# EAGLE design bmscable (EAGLE 4.13)
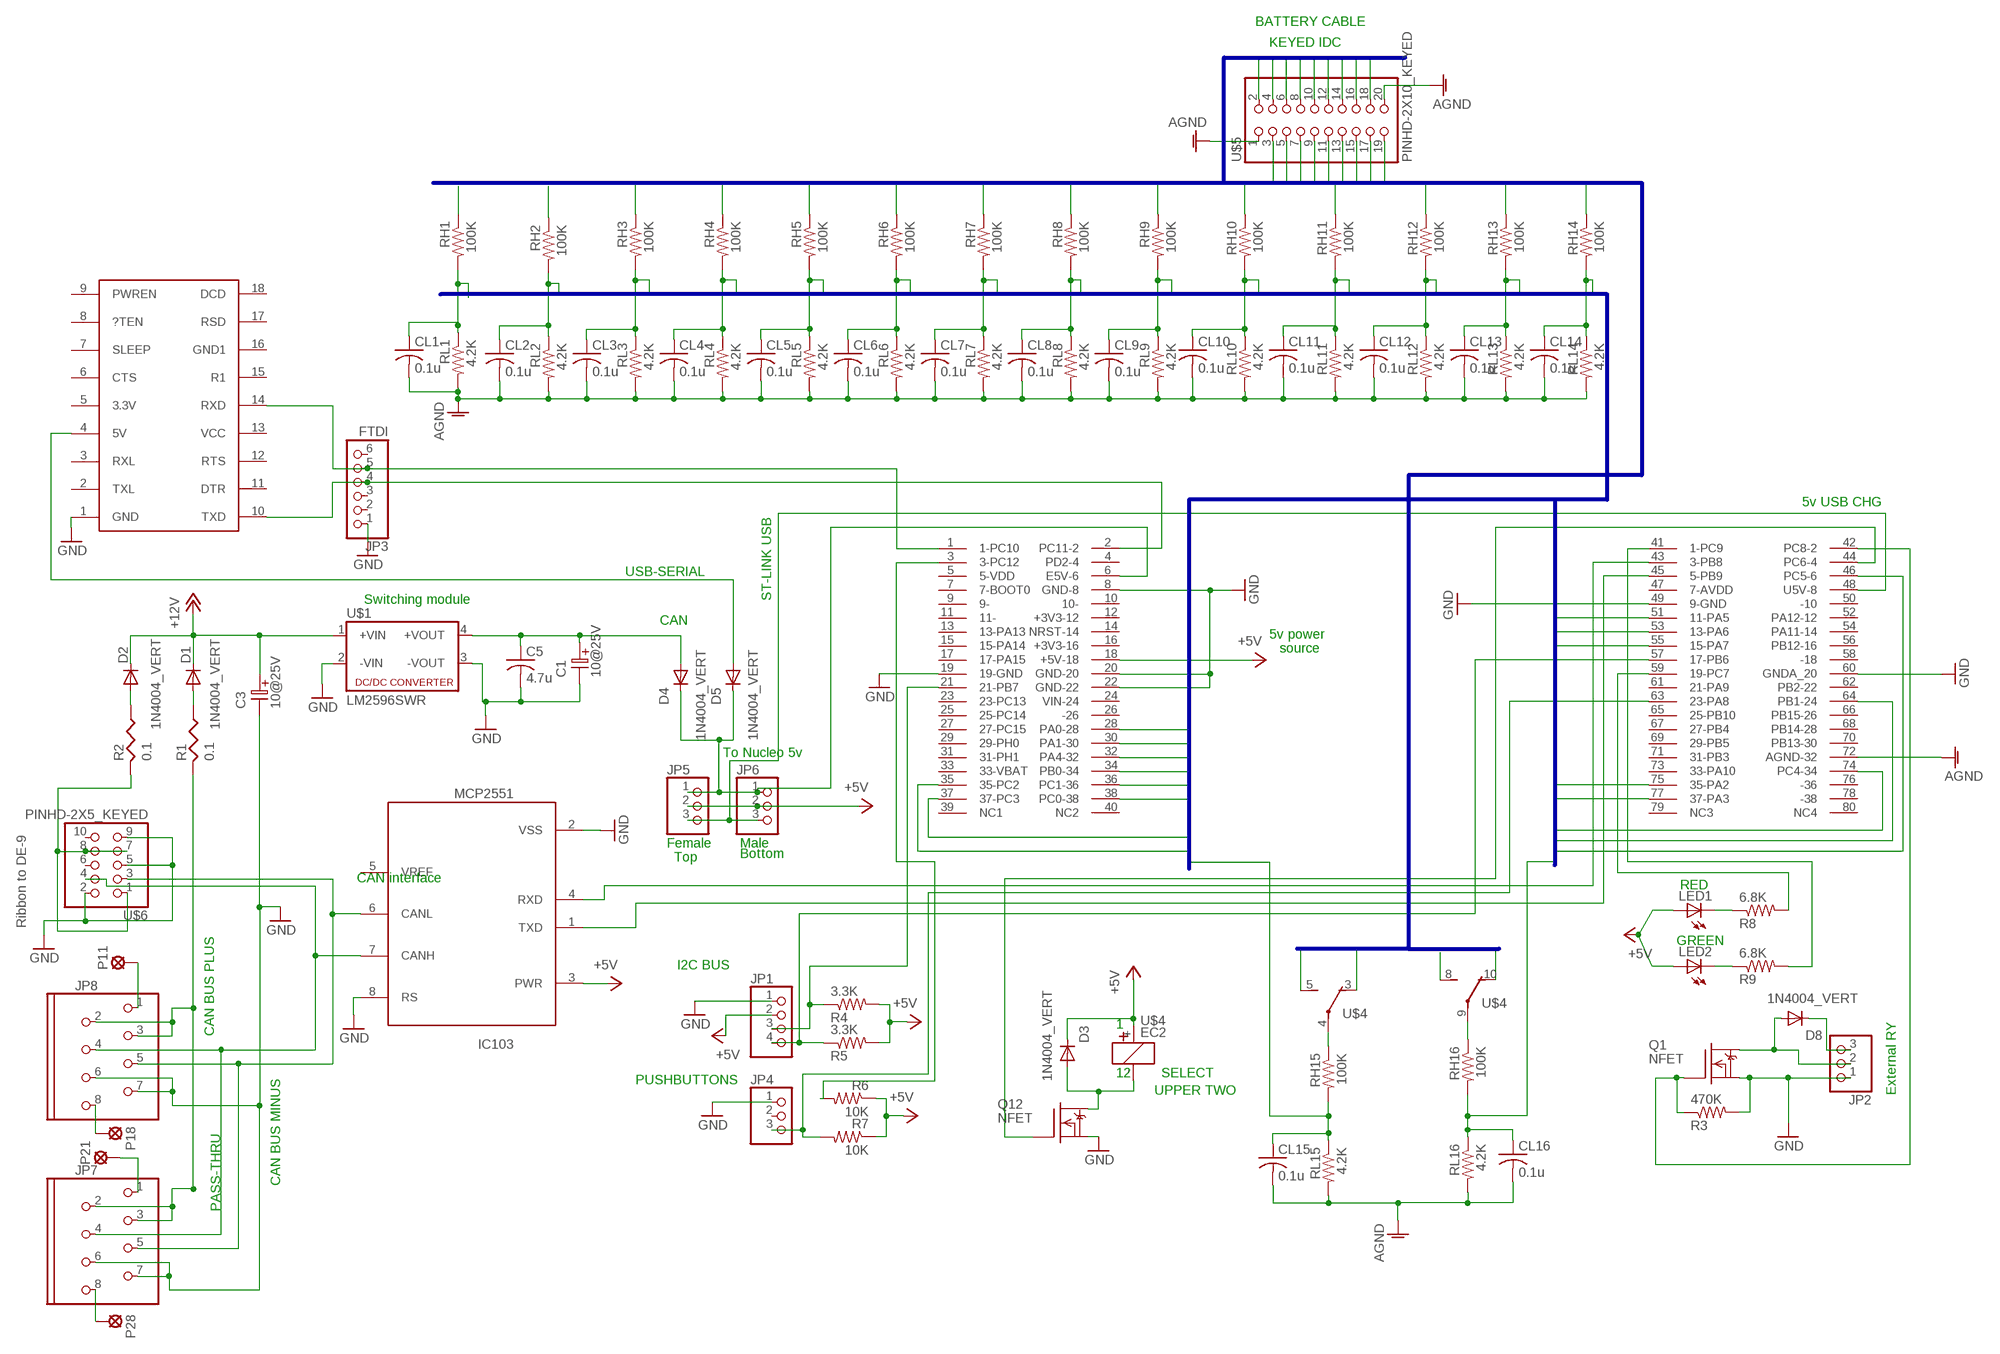
[diagram p0: schematic, sheet 1]

## Parts
C1  10@25V  ELC-2,5L  [ES-2,5L]
C3  10@25V  ELC-2,5L  [ES-2,5L]
C5  4.7u  C-USC0603  [C0603]
CL1  0.1u  C-USC0603  [C0603]
CL2  0.1u  C-USC0603  [C0603]
CL3  0.1u  C-USC0603  [C0603]
CL4  0.1u  C-USC0603  [C0603]
CL5  0.1u  C-USC0603  [C0603]
CL6  0.1u  C-USC0603  [C0603]
CL7  0.1u  C-USC0603  [C0603]
CL8  0.1u  C-USC0603  [C0603]
CL9  0.1u  C-USC0603  [C0603]
CL10  0.1u  C-USC0603  [C0603]
CL11  0.1u  C-USC0603  [C0603]
CL12  0.1u  C-USC0603  [C0603]
CL13  0.1u  C-USC0603  [C0603]
CL14  0.1u  C-USC0603  [C0603]
CL15  0.1u  C-USC0603  [C0603]
CL16  0.1u  C-USC0603  [C0603]
D1  1N4004_VERT  [DO41-10_VERT]
D2  1N4004_VERT  [DO41-10_VERT]
D3  1N4004_VERT  [DO41-10_VERT]
D4  1N4004_VERT  [DO41-10_VERT]
D5  1N4004_VERT  [DO41-10_VERT]
D8  1N4004_VERT  [DO41-10_VERT]
IC103  MCP2551  [SO-08]
JP1  PINHD-1X4  [1X04]
JP2  PINHD-1X3  [1X03]
JP3  FTDI  PINHD-1X6  [1X06]
JP4  PINHD-1X3  [1X03]
JP5  PINHD-1X3  [1X03]
JP6  PINHD-1X3  [1X03]
JP7  MOD8P8C  [MOD8P8C]
JP8  MOD8P8C  [MOD8P8C]
LED1  LEDCHIP-LED0603  [CHIP-LED0603]
LED2  LEDCHIP-LED0603  [CHIP-LED0603]
P11  SOLPAD035  [SOLDPAD035]
P18  SOLPAD035  [SOLDPAD035]
P21  SOLPAD035  [SOLDPAD035]
P28  SOLPAD035  [SOLDPAD035]
Q1  NFET  DMN3404L  [SOT-23]
Q12  NFET  DMN3404L  [SOT-23]
R1  0.1  RESUS-S2,5  [RS-2,5]
R2  0.1  RESUS-S2,5  [RS-2,5]
R3  470K  R-US_R0603  [R0603]
R4  3.3K  R-US_R0603  [R0603]
R5  3.3K  R-US_R0603  [R0603]
R6  10K  R-US_R0603  [R0603]
R7  10K  R-US_R0603  [R0603]
R8  6.8K  R-US_R0603  [R0603]
R9  6.8K  R-US_R0603  [R0603]
RH1  100K  R-US_R0603  [R0603]
RH2  100K  R-US_R0603  [R0603]
RH3  100K  R-US_R0603  [R0603]
RH4  100K  R-US_R0603  [R0603]
RH5  100K  R-US_R0603  [R0603]
RH6  100K  R-US_R0603  [R0603]
RH7  100K  R-US_R0603  [R0603]
RH8  100K  R-US_R0603  [R0603]
RH9  100K  R-US_R0603  [R0603]
RH10  100K  R-US_R0603  [R0603]
RH11  100K  R-US_R0603  [R0603]
RH12  100K  R-US_R0603  [R0603]
RH13  100K  R-US_R0603  [R0603]
RH14  100K  R-US_R0603  [R0603]
RH15  100K  R-US_R0603  [R0603]
RH16  100K  R-US_R0603  [R0603]
RL1  4.2K  R-US_R0603  [R0603]
RL2  4.2K  R-US_R0603  [R0603]
RL3  4.2K  R-US_R0603  [R0603]
RL4  4.2K  R-US_R0603  [R0603]
RL5  4.2K  R-US_R0603  [R0603]
RL6  4.2K  R-US_R0603  [R0603]
RL7  4.2K  R-US_R0603  [R0603]
RL8  4.2K  R-US_R0603  [R0603]
RL9  4.2K  R-US_R0603  [R0603]
RL10  4.2K  R-US_R0603  [R0603]
RL11  4.2K  R-US_R0603  [R0603]
RL12  4.2K  R-US_R0603  [R0603]
RL13  4.2K  R-US_R0603  [R0603]
RL14  4.2K  R-US_R0603  [R0603]
RL15  4.2K  R-US_R0603  [R0603]
RL16  4.2K  R-US_R0603  [R0603]
U$1  LM2596SWR  [LM2596SW]
U$2  NUCLEO446R-20  [NUCLEO-64-20]
U$3  USB-UART  [USB-UART]
U$4  EC2  [EC2]
U$5  PINHD-2X10_KEYED  [2X10_KEYED]
U$6  PINHD-2X5_KEYED  [2X05_KEYED]

## Nets
+5V: D3.C IC103.3(PWR) JP1.2 JP5.2 JP6.2 LED1.A LED2.A R4.2 R5.2 R6.1 R7.1 U$2.18(+5V-18) U$4.+
+12V: C3.1 D1.C D2.C U$1.1(+VIN)
ADC0: CL1.1 RH1.2 RL1.1 U$2.28(PA0-28)
ADC1: CL2.1 RH2.2 RL2.1 U$2.30(PA1-30)
ADC2: CL3.1 RH3.2 RL3.1 U$2.75(35-PA2)
ADC3: CL4.1 RH4.2 RL4.1 U$2.77(37-PA3)
ADC4: CL5.1 RH5.2 RL5.1 U$2.32(PA4-32)
ADC5: CL6.1 RH6.2 RL6.1 U$2.51(11-PA5)
ADC6: CL7.1 RH7.2 RL7.1 U$2.53(13-PA6)
ADC7: CL8.1 RH8.2 RL8.1 U$2.55(15-PA7)
ADC8: CL9.1 RH9.2 RL9.1 U$2.34(PB0-34)
ADC9: CL10.1 RH10.2 RL10.1 U$2.64(PB1-24)
ADC10: CL11.1 RH11.2 RL11.1 U$2.38(PC0-38)
ADC11: CL12.1 RH12.2 RL12.1 U$2.36(PC1-36)
ADC12: CL13.1 RH13.2 RL13.1 U$2.35(35-PC2)
ADC13: CL14.1 RH14.2 RL14.1 U$2.37(37-PC3)
ADC14: CL15.1 RH15.2 RL15.1 U$2.74(PC4-34)
ADC15: CL16.1 RH16.2 RL16.1 U$2.46(PC5-6)
AGND: CL1.2 CL2.2 CL3.2 CL4.2 CL5.2 CL6.2 CL7.2 CL8.2 CL9.2 CL10.2 CL11.2 CL12.2 CL13.2 CL14.2 CL15.2 CL16.2 RL1.2 RL2.2 RL3.2 RL4.2 RL5.2 RL6.2 RL7.2 RL8.2 RL9.2 RL10.2 RL11.2 RL12.2 RL13.2 RL14.2 RL15.2 RL16.2 U$2.72(AGND-32) U$5.1 U$5.20
C1: RH1.1 U$5.11
C2: RH2.1 U$5.2
C3: RH3.1 U$5.12
C4: RH4.1 U$5.3
C5: RH5.1 U$5.13
C6: RH6.1 U$5.4
C7: RH7.1 U$5.14
C8: RH8.1 U$5.5
C9: RH9.1 U$5.15
C10: RH10.1 U$5.6
C11: RH11.1 U$5.16
C12: RH12.1 U$5.7
C13: RH13.1 U$5.17
C14: RH14.1 U$5.8
C15: U$4.5(S) U$5.18
C16: U$4.8(S) U$5.9
C17: U$4.3(O) U$5.19
C18: U$4.10(O) U$5.10
CAN_RAW_PLUS: JP7.2 JP7.3 JP8.2 JP8.3 R1.2
CANCABLE_1_1: JP8.1 P11.MP
CANCABLE_1_8: JP8.8 P18.MP
CANCABLE_2_1: JP7.1 P21.MP
CANCABLE_2_8: JP7.8 P28.MP
D1-RESISTOR: D1.A R1.1
D2-RESISTOR: D2.A R2.1
E5V->NUCLEO: D4.C D5.C JP5.1 JP6.1 U$2.6(E5V-6)
FROM-DC-DC=CAN: C1.1 C5.1 D4.A U$1.4(+VOUT)
FROM-U5V: JP5.3 JP6.3 U$2.48(U5V-8)
FROM-USB-UART: D5.A U$3.4(5V)
GND: C1.2 C3.2 C5.2 IC103.2(VSS) IC103.8(RS) JP1.1 JP2.1 JP3.1 JP4.1 JP7.6 JP7.7 JP8.6 JP8.7 Q1.2(S) Q12.2(S) R3.2 U$1.2(-VIN) U$1.3(-VOUT) U$2.8(GND-8) U$2.19(19-GND) U$2.20(GND-20) U$2.22(GND-22) U$2.49(9-GND) U$2.60(GNDA_20) U$3.1(GND) U$6.2 U$6.5 U$6.9
MCP2551_CANH: IC103.7(CANH) JP7.4 JP8.4 U$6.4
MCP2551_CANL: IC103.6(CANL) JP7.5 JP8.5 U$6.3
N$3: R2.2 U$6.1 U$6.7 U$6.8
N$4: D8.A JP2.2 Q1.3(D)
N$5: D8.C JP2.3
N$6: JP4.3 R7.2 U$2.63(23-PA8)
N$7: LED2.C R9.1
N$8: RH16.1 U$4.9(P)
N$9: RH15.1 U$4.4(P)
N$10: LED1.C R8.1
PB6-I2C1-SCL: JP1.4 R5.1 U$2.57(17-PB6)
PB7-I2C1-SCL: JP1.3 R4.1 U$2.21(21-PB7)
PB8-CAN-RX: IC103.4(RXD) U$2.43(3-PB8)
PB9-CAN-TX: IC103.1(TXD) U$2.45(5-PB9)
PC6-Q12-GATE: Q12.1(G) U$2.44(PC6-4)
PC7-LED-GREEN: R8.2 U$2.59(19-PC7)
PC8-FETGATE-CHGR-RELAY: Q1.1(G) R3.1 U$2.42(PC8-2)
PC9-LED-RED: R9.2 U$2.41(1-PC9)
PC12-SWITCH: R6.2 U$2.3(3-PC12)
Q12-DRAIN-RELAY: D3.A Q12.3(D) U$4.-
USART3-RX: JP3.4 U$2.2(PC11-2) U$3.10(TXD)
USART3-TX: JP3.5 U$2.1(1-PC10) U$3.14(RXD)
Unconnected: IC103.5(VREF) JP3.2 JP3.3 JP3.6 JP4.2 U$2.4(PD2-4) U$2.5(5-VDD) U$2.7(7-BOOT0) U$2.9(9-) U$2.10(10-) U$2.11(11-) U$2.12(+3V3-12) U$2.13(13-PA13) U$2.14(NRST-14) U$2.15(15-PA14) U$2.16(+3V3-16) U$2.17(17-PA15) U$2.23(23-PC13) U$2.24(VIN-24) U$2.25(25-PC14) U$2.26(-26) U$2.27(27-PC15) U$2.29(29-PH0) U$2.31(31-PH1) U$2.33(33-VBAT) U$2.39(NC1) U$2.40(NC2) U$2.47(7-AVDD) U$2.50(-10) U$2.52(PA12-12) U$2.54(PA11-14) U$2.56(PB12-16) U$2.58(-18) U$2.61(21-PA9) U$2.62(PB2-22) U$2.65(25-PB10) U$2.66(PB15-26) U$2.67(27-PB4) U$2.68(PB14-28) U$2.69(29-PB5) U$2.70(PB13-30) U$2.71(31-PB3) U$2.73(33-PA10) U$2.76(-36) U$2.78(-38) U$2.79(NC3) U$2.80(NC4) U$3.2(TXL) U$3.3(RXL) U$3.5(3.3V) U$3.6(CTS) U$3.7(SLEEP) U$3.8(?TEN) U$3.9(PWREN) U$3.11(DTR) U$3.12(RTS) U$3.13(VCC) U$3.15(R1) U$3.16(GND1) U$3.17(RSD) U$3.18(DCD) U$6.6 U$6.10

## Buses
C$1:C[0..18]
ADC$:ADC[0..15]

## Notes on the sheet
- BATTERY CABLE
- KEYED IDC
- 5v USB CHG
- USB-SERIAL
- Switching module | ST-LINK USB
- CAN
- 5v power
- source
- To Nucleo 5v
- Female | Male
- Top | Bottom
- CAN interface
- RED
- Ribbon to DE-9
- GREEN
- I2C BUS
- 1
- CAN BUS PLUS
- 12 | SELECT
- PUSHBUTTONS
- UPPER TWO | External RY
- PASS-THRU
- CAN BUS MINUS

## Library data of the parts
C1 C3 = DEH:ELC-2,5L
C5 CL1-CL16 = rcl:C-US: CAPACITOR, American symbol
D1-D5 D8 = diode:1N4004_VERT
IC103 = texas:MCP2551
JP1 = pinhead:PINHD-1X4: PIN HEADER
JP2 JP4-JP6 = pinhead:PINHD-1X3: PIN HEADER
JP3 = pinhead:PINHD-1X6: PIN HEADER
JP7 JP8 = DEH:MOD8P8C
LED1 LED2 = led:LED: LED OSRAM: - CHIPLED LG R971, LG N971, LY N971, LG Q971, LY Q971, LO R971, LY R971 LH N974, LH R974 LS Q976, LO Q976, LY Q976 LO Q996 - Hyper CHIPLED LW Q18S LB Q993, LB Q99A, LB R99A - SideLED LS A670, LO A670, LY A670, LG A670, LP A670 LB A673, LV A673, LT A673, LW A673 LH A674 LY A675 LS A676, LA A676, LO A676, LY A676, LW A676 LS A679, LY A679, LG A679 - Hyper Micro SIDELED® LS Y876, LA Y876, LO Y876, LY Y876 LT Y87S - SmartLED LW L88C, LW L88S LB L89C, LB L89S, LG L890 LS L89K, LO L89K, LY L89K LS L896, LA L896, LO L896, LY L896 - TOPLED LS T670, LO T670, LY T670, LG T670, LP T670 LSG T670, LSP T670, LSY T670, LOP T670, LYG T670 LG T671, LOG T671, LSG T671 LB T673, LV T673, LT T673, LW T673 LH T674 LS T676, LA T676, LO T676, LY T676, LB T676, LH T676, LSB T676, LW T676 LB T67C, LV T67C, LT T67C, LS T67K, LO T67K, LY T67K, LW E67C LS E67B, LA E67B, LO E67B, LY E67B, LB E67C, LV E67C, LT E67C LW T67C LS T679, LY T679, LG T679 LS T770, LO T770, LY T770, LG T770, LP T770 LB T773, LV T773, LT T773, LW T773 LH T774 LS E675, LA E675, LY E675, LS T675 LS T776, LA T776, LO T776, LY T776, LB T776 LHGB T686 LT T68C, LB T68C - Hyper Mini TOPLED® LB M676 - Mini TOPLED Santana® LG M470 LS M47K, LO M47K, LY M47K Source: http://www.osram.convergy.de/
P11 P18 P21 P28 = solpad:SOLPAD035
Q1 Q12 = transistor-fet:DMN3404L
R1 R2 = DEH:RESUS-S2,5
R3-R9 RH1-RH16 RL1-RL16 = rcl:R-US_: RESISTOR, American symbol
U$1 = dc-dc-converter:LM2596SWR
U$2 = pinhead:NUCLEO446R-20
U$3 = pinhead:USB-UART
U$4 = relay:EC2
U$5 = pinhead:PINHD-2X10_KEYED
U$6 = pinhead:PINHD-2X5_KEYED

## Board
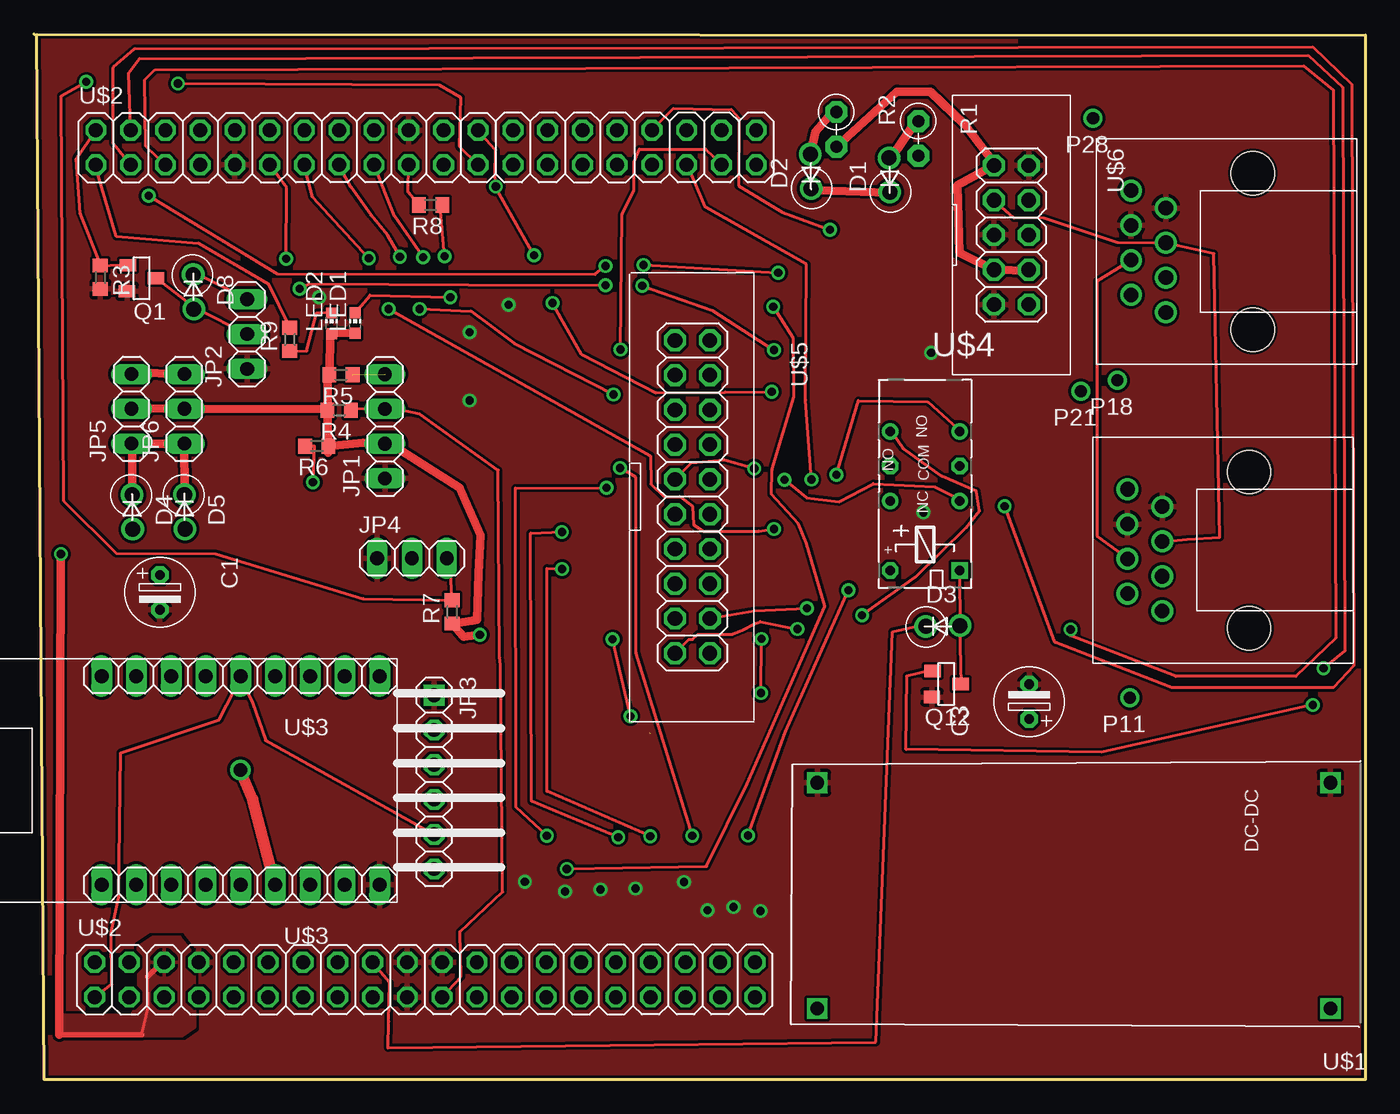
[diagram p1: board, top side]
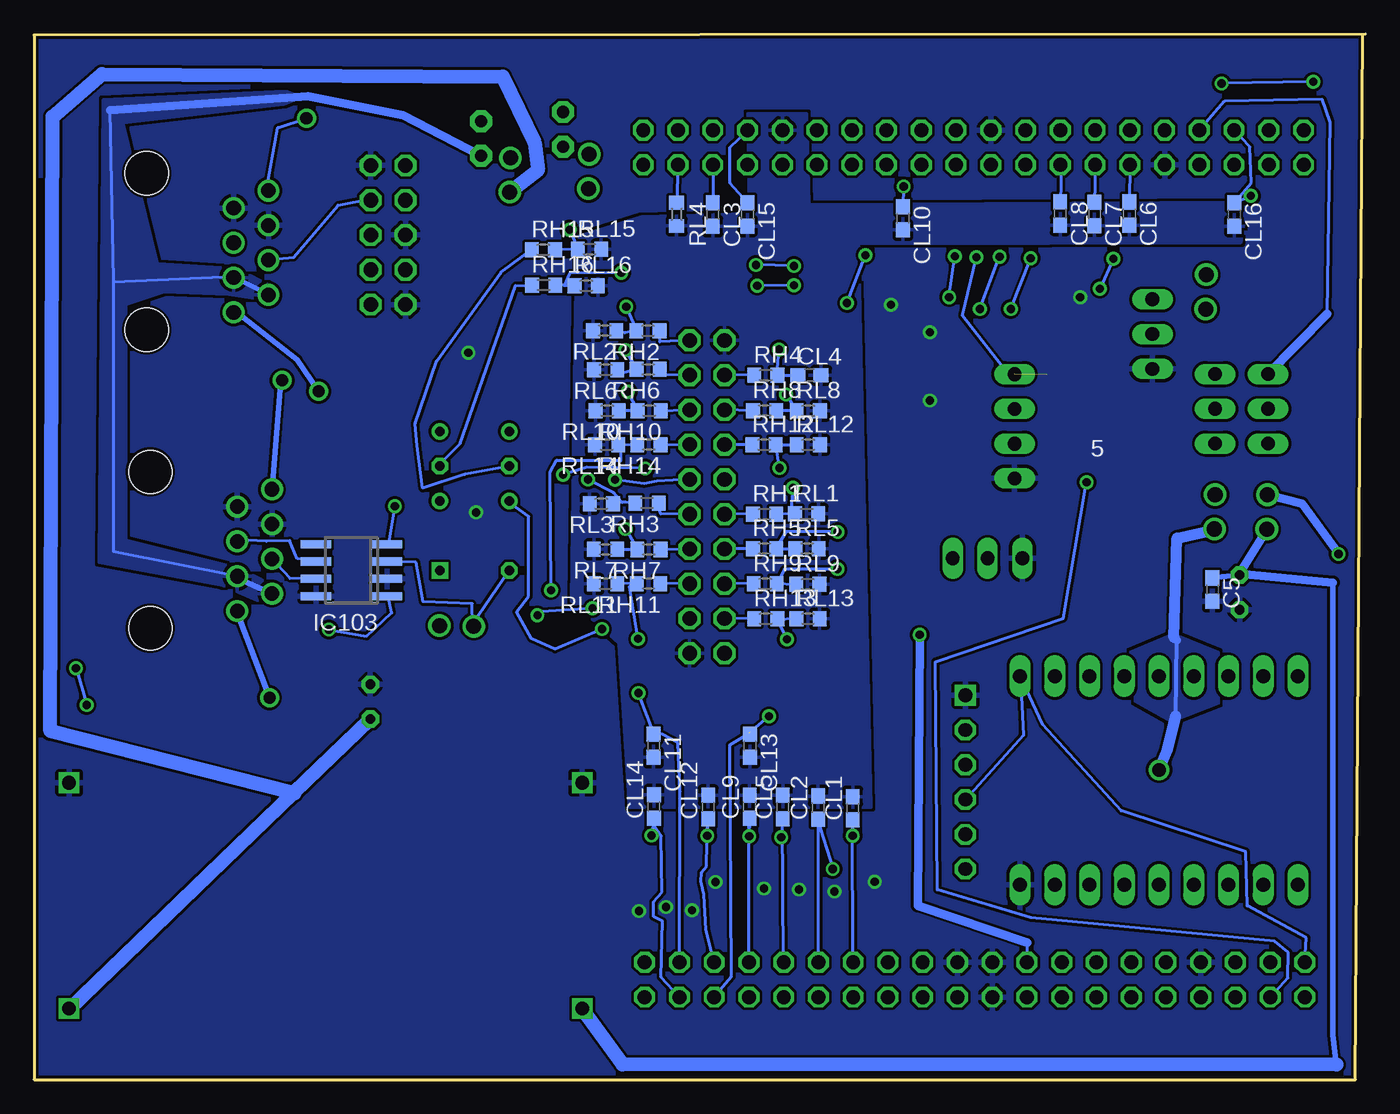
[diagram p2: board, bottom side, seen from below]

Size 97.29 x 76.38 mm. Coordinates in mm from the lower left corner, seen from the top.
Outline: 0.19,76.35 0.72,0 97.29,0 97.29,76.31 0,76.38
Copper layers (1*16): Top 0.035mm / dielectric 1.5mm / Bottom 0.035mm
Design rules "default": minimum track width 8mil, minimum drill 0.6mm, track to track 8mil, track to pad 8mil, pad to pad 8mil, via to via 8mil, smd to smd 0mil, copper to edge 8mil, drill to drill 8mil, minimum pad ring 10mil, minimum via ring 8mil, stop-mask expansion 4mil, vias tented up to drill 0mil, thermal gap 10mil

### Footprints (pad centres in the part's own frame; a part is rotated, then mirrored left to right if it is on the bottom)
ES-2,5L = drill 0.711 pad 1.27 octagon: 1 0,0; 2 2.54,0
C0603 = smd 1.1 x 1: 1 -0.85,0; 2 0.85,0
DO41-10_VERT = drill 1.1 round: A 2.58,0.05; C 0.07,0
SO-08 = smd 0.6 x 2.2: 1 -1.905,-2.6; 2 -0.635,-2.6; 3 0.635,-2.6; 4 1.905,-2.6; 5 1.905,2.6; 6 0.635,2.6; 7 -0.635,2.6; 8 -1.905,2.6
1X04 = drill 1 long: 1 -3.81,0; 2 -1.27,0; 3 1.27,0; 4 3.81,0
1X03 = drill 1 long: 1 -2.54,0; 2 0,0; 3 2.54,0
1X06 = drill 1 square: 1 -6.35,0 | drill 1 octagon: 2 -3.81,0; 3 -1.27,0; 4 1.27,0; 5 3.81,0; 6 6.35,0
MOD8P8C = drill 1.067 pad 1.397 round: 1 -3.81,-2.54; 2 -2.54,0; 3 -1.27,-2.54; 4 0,0; 5 1.27,-2.54; 6 2.54,0; 7 3.81,-2.54; 8 5.08,0 | hole 3.175: -5.08,-8.89; 6.35,-8.89
CHIP-LED0603 = smd 0.8 x 0.8: A 0,-0.75; C 0,0.75
SOLDPAD035 = drill 0.889 pad 1.27 round: MP 0,0
SOT-23 = smd 0.9 x 1.2: 1 -1,-1.006; 2 0.9,-1.056; 3 -0.05,1.056
RS-2,5 = drill 0.889 pad 1.6 octagon: 1 0,0; 2 2.54,0
R0603 = smd 1 x 1.1: 1 -0.85,0; 2 0.85,0
LM2596SW = drill 1 square: 1 0,16.5; 2 0,0; 3 37.5,0; 4 37.5,16.5
NUCLEO-64-20 = drill 1.016 octagon: 1 -31.68,24.23; 2 -29.14,24.23; 3 -31.68,21.69; 4 -29.14,21.69; 5 -31.68,19.15; 6 -29.14,19.15; 7 -31.68,16.61; 8 -29.14,16.61; 9 -31.68,14.07; 10 -29.14,14.07; 11 -31.68,11.53; 12 -29.14,11.53; 13 -31.68,8.99; 14 -29.14,8.99; 15 -31.68,6.45; 16 -29.14,6.45; 17 -31.68,3.91; 18 -29.14,3.91; 19 -31.68,1.37; 20 -29.14,1.37; 21 -31.68,-1.17; 22 -29.14,-1.17; 23 -31.68,-3.71; 24 -29.14,-3.71; 25 -31.68,-6.25; 26 -29.14,-6.25; 27 -31.68,-8.79; 28 -29.14,-8.79; 29 -31.68,-11.33; 30 -29.14,-11.33; 31 -31.68,-13.87; 32 -29.14,-13.87; 33 -31.68,-16.41; 34 -29.14,-16.41; 35 -31.68,-18.95; 36 -29.14,-18.95; 37 -31.68,-21.49; 38 -29.14,-21.49; 39 -31.68,-24.03; 40 -29.14,-24.03; 41 29.12,24.13; 42 31.66,24.13; 43 29.12,21.59; 44 31.66,21.59; 45 29.12,19.05; 46 31.66,19.05; 47 29.12,16.51; 48 31.66,16.51; 49 29.12,13.97; 50 31.66,13.97; 51 29.12,11.43; 52 31.66,11.43; 53 29.12,8.89; 54 31.66,8.89; 55 29.12,6.35; 56 31.66,6.35; 57 29.12,3.81; 58 31.66,3.81; 59 29.12,1.27; 60 31.66,1.27; 61 29.12,-1.27; 62 31.66,-1.27; 63 29.12,-3.81; 64 31.66,-3.81; 65 29.12,-6.35; 66 31.66,-6.35; 67 29.12,-8.89; 68 31.66,-8.89; 69 29.12,-11.43; 70 31.66,-11.43; 71 29.12,-13.97; 72 31.66,-13.97; 73 29.12,-16.51; 74 31.66,-16.51; 75 29.12,-19.05; 76 31.66,-19.05; 77 29.12,-21.59; 78 31.66,-21.59; 79 29.12,-24.13; 80 31.66,-24.13
USB-UART = drill 1.016 long: 1 -7.62,-8.89; 2 -7.62,-6.35; 3 -7.62,-3.81; 4 -7.62,-1.27; 5 -7.62,1.27; 6 -7.62,3.81; 7 -7.62,6.35; 8 -7.62,8.89; 9 -7.62,11.43; 10 7.62,-8.89; 11 7.62,-6.35; 12 7.62,-3.81; 13 7.62,-1.27; 14 7.62,1.27; 15 7.62,3.81; 16 7.62,6.35; 17 7.62,8.89; 18 7.62,11.43
EC2 = drill 0.7 round: 3 -1.27,2.54; 5 3.81,2.54; 8 3.81,-2.54; 10 -1.27,-2.54 | drill 0.7 octagon: 4 1.27,2.54; 9 1.27,-2.54; + -6.35,2.54 | drill 0.7 square: - -6.35,-2.54
2X10_KEYED = drill 1.067 octagon: 1 -11.46,-1.27; 2 -11.46,1.27; 3 -8.92,-1.27; 4 -8.92,1.27; 5 -6.38,-1.27; 6 -6.38,1.27; 7 -3.84,-1.27; 8 -3.84,1.27; 9 -1.3,-1.27; 10 -1.3,1.27; 11 1.24,-1.27; 12 1.24,1.27; 13 3.78,-1.27; 14 3.78,1.27; 15 6.32,-1.27; 16 6.32,1.27; 17 8.86,-1.27; 18 8.86,1.27; 19 11.4,-1.27; 20 11.4,1.27
2X05_KEYED = drill 1.067 octagon: 1 -5.08,-1.27; 2 -5.08,1.27; 3 -2.54,-1.27; 4 -2.54,1.27; 5 0,-1.27; 6 0,1.27; 7 2.54,-1.27; 8 2.54,1.27; 9 5.08,-1.27; 10 5.08,1.27

### Placement (x,y rotation side)
C1  9.19,36.87 270 top
C3  72.72,26.34 90 top
C5  11.18,35.8 270 bottom
CL1  37.46,19.83 90 bottom
CL2  39.99,19.87 90 bottom
CL3  47.69,63.2 270 bottom
CL4  40.63,51.46 0 bottom
CL5  42.57,19.91 90 bottom
CL6  17.25,63.27 270 bottom
CL7  19.8,63.24 270 bottom
CL8  22.3,63.28 270 bottom
CL9  45,19.93 90 bottom
CL10  33.8,62.93 270 bottom
CL11  52.02,24.39 270 bottom
CL12  48.03,19.91 90 bottom
CL13  44.98,24.39 270 bottom
CL14  51.99,19.95 90 bottom
CL15  45.16,63.21 270 bottom
CL16  9.58,63.21 270 bottom
D1  62.53,64.77 90 top
D2  56.78,65.03 90 top
D3  65.09,33.12 0 top
D4  7.15,42.8 270 top
D5  10.98,42.81 270 top
D8  11.62,58.88 270 top
IC103  74.1,37.22 90 bottom
JP1  25.64,47.73 90 top
JP2  15.56,54.47 90 top
JP3  29.23,21.73 270 top
JP4  27.61,38.09 0 top
JP5  7.11,49.01 90 top
JP6  10.97,49.01 90 top
JP7  80.17,59.87 90 top
JP8  79.91,38.05 90 top
LED1  23.46,55.27 0 top
LED2  21.73,55.26 0 top
P11  80.09,27.9 180 top
P18  79.17,51.09 180 top
P21  76.5,50.3 180 top
P28  77.39,70.24 180 top
Q1  7.85,58.5 270 top
Q12  66.67,28.85 270 top
R1  64.62,70.03 270 top
R2  58.63,70.7 270 top
R3  4.84,58.62 270 top
R4  22.29,48.9 180 top
R5  22.42,51.49 180 top
R6  20.65,46.29 180 top
R7  30.54,34.17 90 top
R8  28.97,63.9 180 top
R9  18.68,54.08 90 top
RH1  43.91,41.31 0 bottom
RH2  52.43,54.71 180 bottom
RH3  52.5,42.12 180 bottom
RH4  43.82,51.46 0 bottom
RH5  43.91,38.8 0 bottom
RH6  52.41,51.89 180 bottom
RH7  52.36,38.73 180 bottom
RH8  43.9,48.88 0 bottom
RH9  43.86,36.22 0 bottom
RH10  52.34,48.87 180 bottom
RH11  52.39,36.24 180 bottom
RH12  43.94,46.39 0 bottom
RH13  43.82,33.67 0 bottom
RH14  52.36,46.4 180 bottom
RH15  60.07,60.63 0 bottom
RH16  60.05,58.05 0 bottom
RL1  40.83,41.33 0 bottom
RL2  55.59,54.73 180 bottom
RL3  55.84,42.08 180 bottom
RL4  50.33,63.22 270 bottom
RL5  40.8,38.8 0 bottom
RL6  55.52,51.87 180 bottom
RL7  55.53,38.74 180 bottom
RL8  40.71,48.86 0 bottom
RL9  40.75,36.19 0 bottom
RL10  55.41,48.87 180 bottom
RL11  55.53,36.22 180 bottom
RL12  40.71,46.38 0 bottom
RL13  40.73,33.67 0 bottom
RL14  55.45,46.38 180 bottom
RL15  56.7,60.66 0 bottom
RL16  56.94,58.01 0 bottom
U$1  94.74,21.69 180 top
U$2  28.64,37.71 90 top
U$3  16.35,21.86 90 top
U$4  65.11,43.55 90 top
U$5  48.11,42.55 270 top
U$6  71.42,61.71 270 top

### Tracks (layer width: path | path; a pad name or v marks a point on that pad's centre or on a via)
+5V  (via drill 0.6)
  Top 0.203: U$2.18 24.67,8.62 25.97,7.07 25.91,4.23 25.85,2.31 61.51,2.74 62.74,32.71 65,33.22 D3.C
  Top 0.61: JP5.2 7.04,49.05 JP6.2 21.5,48.99 R4.2 | LED1.A 21.86,54.56 LED2.A 21.68,54.61 R5.2 21.43,51.53 R4.2 | R4.2 21.49,45.8 R6.1 24.05,46.53 26.08,46.41 | 26.08,46.41 JP1.2 | 26.08,46.41 31.1,43.25 32.61,39.77 32.47,37 32.38,33.61 32.02,33.53 R7.1 31.39,32.35 v32.57,32.5
  Bottom 0.203: IC103.3 69.38,37.79 68.88,34.93 65.28,34.77 65.24,33.23 D3.C 65.28,33.27 U$4.+ | U$2.18 24.68,10
  Bottom 0.61: 24.68,10 32.7,12.71 v32.57,32.5
+12V
  Top 0.203: 57.22,64.97 D2.C | D1.C 62.51,64.78
  Top 0.61: 62.51,64.78 57.22,64.97
  Bottom 0.406: 94.76,5.09 U$1.1 94.71,5.09
  Bottom 1.016: 94.76,5.09 78.31,20.95 | 78.31,20.95 C3.1 | D1.C 60.48,66.45 60.72,68.46 63.05,73.29 92.34,73.47 95.94,70.36 96.11,25.46 78.28,20.92 78.31,20.95
ADC0  (via drill 0.6)
  Top 0.203: v37.47,17.82 35.21,19.9 35.18,43.21 v41.84,43.25
  Bottom 0.203: 37.5,19.05 CL1.1 | U$2.28 37.5,19.05 | RH1.2 42.98,41.3 RL1.1 42.01,41.35 v41.84,43.25 | 37.5,19.05 v37.47,17.82
ADC1  (via drill 0.6)
  Top 0.203: v54.02,56.46 55.49,54.16 55.52,49.9 53.94,44.55 53.87,42.78 55.85,40.62 56.44,39.17 57.78,34.59 52.1,21.59 49.14,15.57 v38.92,15.39
  Bottom 0.203: RL2.1 54.13,54.55 RH2.2 v54.02,56.46 | U$2.30 39.96,19.08 CL2.1 40.04,19 v38.92,15.39
ADC2  (via drill 0.6)
  Top 0.203: v56.81,43.84 56.38,49.64 56.44,59.56 49.05,63.74 47.75,66.84 U$2.75
  Bottom 0.203: U$2.75 47.66,66.74 CL3.1 | RL3.1 54.32,42.17 RH3.2 54.39,42.23 54.95,42.86 v56.81,43.84
ADC3  (via drill 0.6)
  Top 0.203: U$2.77 50.22,66.88 49.08,67.99 44.24,67.99 43.84,67.02 43.84,64.97 42.98,63.19 v42.85,53.35
  Bottom 0.203: RH4.2 43.01,51.47 | 43.01,51.47 CL4.1 | U$2.77 50.22,66.8 RL4.1 | 43.01,51.47 v42.85,53.35
ADC4  (via drill 0.6)
  Top 0.203: v38.57,40.01 36.28,39.92 36.37,20.32 v42.69,17.71
  Bottom 0.203: U$2.32 42.6,19.13 CL5.1 42.59,19.06 v42.69,17.71 | RL5.1 43.11,38.79 RH5.2 42.35,40.02 v38.57,40.01
ADC5  (via drill 0.6)
  Top 0.203: v54.07,53.3 49.55,56.2 v44.44,58.01 | v41.76,58.04 31.74,58.06 20.09,58.15 v19.4,57.79 | v18.42,59.97 18.45,65.15 17.22,66.86 U$2.51
  Bottom 0.203: RL6.1 54.68,51.5 RH6.2 v54.07,53.3 | U$2.51 17.21,66.86 CL6.1 | v41.76,58.04 v44.44,58.01 | v18.42,59.97 v19.4,57.79
ADC6  (via drill 0.6)
  Top 0.203: v54.07,40.23 52.96,40.07 48.93,40.06 48.19,40.53 48.13,41.89 47.2,42.6 46.02,42.59 45.07,43.51 45.03,45.58 v25.91,56.31 | v24.46,60.01 20.36,64.48 19.72,66.8 U$2.53
  Bottom 0.203: U$2.53 19.73,66.79 CL7.1 | RL7.1 54.8,38.73 RH7.2 v54.07,40.23 | v25.91,56.31 v24.46,60.01
ADC7  (via drill 0.6)
  Top 0.203: v42.34,50.06 35.09,53.81 31.92,56.14 v28.16,56.31 | v26.73,60.13 25.84,61.69 24.61,63.15 23.15,65.21 22.25,66.83 U$2.55
  Bottom 0.203: RH8.2 43.03,48.86 RL8.1 v42.34,50.06 | U$2.55 22.22,66.86 CL8.1 | v28.16,56.31 v26.73,60.13
ADC8  (via drill 0.6)
  Top 0.203: v38.58,37.3 37.47,37.35 37.47,21.05 v45.03,17.79
  Bottom 0.203: U$2.34 45.03,19.2 CL9.1 45.01,18.95 v45.03,17.79 | RL9.1 41.68,36.18 43.05,36.25 RH9.2 42.46,37.3 v38.58,37.3
ADC9  (via drill 0.6)
  Top 0.203: v33.74,65.26 33.68,66.05 33.73,67.92 32.36,69.39 U$2.64 | v53.91,50.26 50.5,50.23 45.46,50.19 40,53 v37.88,56.74 | v33.74,65.26 33.72,65.24 | v33.74,65.26 33.69,65.27 v36.53,60.24
  Bottom 0.203: RL10.1 54.62,48.86 RH10.2 v53.91,50.26 | v33.74,65.26 CL10.1 | v37.88,56.74 v36.53,60.24
ADC10  (via drill 0.6)
  Top 0.203: v53.12,28.24 v53.16,32.2
  Bottom 0.203: U$2.38 50.08,21.05 50.24,24.61 51.41,25.25 52,25.28 | 52,25.28 CL11.1 | RL11.1 54.64,36.26 RH11.2 53.76,36.05 v53.16,32.2 | 52,25.28 v53.12,28.24
ADC11  (via drill 0.6)
  Top 0.203: v42.82,44.69 43.97,44 44,31.2 v48.1,17.81
  Bottom 0.203: RL12.1 43.05,46.37 RH12.2 v42.82,44.69 | U$2.36 48.19,10.94 48.34,13.52 48.56,14.46 48.53,15.14 48.16,15.6 48.08,19 CL12.1 48.04,18.94 v48.1,17.81
ADC12  (via drill 0.6)  (1 unrouted)
  Top 0.203: v43.58,26.55 v42.28,32.17
  Bottom 0.203: U$2.35 46.34,7.52 46.42,24.48 44.96,25.35 | RL13.1 41.6,33.69 43.04,33.65 RH13.2 v42.28,32.17 | CL13.1 45.03,25.3 v43.58,26.55
ADC13  (via drill 0.6)
  Top 0.203: v52.17,17.84 54.92,25.43 v59.52,35.76
  Bottom 0.203: RH14.2 54.63,46.42 RL14.1 54.4,46.43 54.4,45.2 54.52,45.24 59.1,45.26 59.6,44.38 v59.52,35.76 | U$2.37 51.47,7.49 51.38,11.58 52.01,11.91 52.02,12.99 51.42,13.7 51.47,17.79 51.96,18.49 51.95,19.05 CL14.1 v52.17,17.84
ADC14  (via drill 0.6)
  Top 0.203: v58.17,62.1 54.69,63.39 51.49,65.32 51.52,70.24 50.95,70.87 46.72,70.96 45.13,69.35 U$2.74
  Bottom 0.203: CL15.1 46.43,65.5 46.43,68.11 45.12,69.37 U$2.74 | RH15.2 RL15.1 v58.17,62.1
ADC15  (via drill 0.6)
  Top 0.203: v8.36,64.57 17.74,58.88 41,58.83 v41.76,59.45 | v44.53,59.52 v54.38,58.95
  Bottom 0.203: U$2.46 9.57,69.37 8.44,68.15 8.35,65.54 CL16.1 v8.36,64.57 | RH16.2 58.97,58.07 58.57,58.02 | RL16.1 57.91,57.95 58.57,58.02 | v41.76,59.45 v44.53,59.52 | v54.38,58.95 58.15,58.91 58.57,58.02
AGND
  pour Bottom (rank 2): 53.78,19.88 54.55,31.85 58.03,34.95 57.72,56.2 57.58,61.63 52.86,63.09 45,63.3 45.11,70.63 40.86,70.62 40.65,63.97 8.64,64.13 9.1,61.11 37.03,61.02 36.13,19.88
C1
  Bottom 0.203: U$5.11 46.91,41.33 RH1.1
C2
  Bottom 0.203: RH2.1 51.56,53.91 U$5.2
C3
  Bottom 0.203: RH3.1 51.5,41.33 U$5.12
C4
  Bottom 0.203: U$5.3 46.89,51.49 RH4.1
C5
  Bottom 0.203: RH5.1 44.73,38.8 U$5.13
C6
  Bottom 0.203: RH6.1 51.92,51.5 U$5.4
C7
  Bottom 0.203: RH7.1 51.7,38.74 U$5.14
C8
  Bottom 0.203: U$5.5 46.88,48.94 RH8.1
C9
  Bottom 0.203: RH9.1 44.71,36.26 U$5.15
C10
  Bottom 0.203: RH10.1 51.76,48.88 U$5.6
C11
  Bottom 0.203: RH11.1 51.7,36.28 U$5.16
C12
  Bottom 0.203: U$5.7 RH12.1
C13
  Bottom 0.203: RH13.1 44.4,33.68 U$5.17
C14
  Bottom 0.203: RH14.1 51.76,46.43 U$5.8
C15  (via drill 0.6)
  Top 0.203: U$5.18 52.64,34.27 v56.48,34.44 | v60.51,33.93 64.43,36.73 68.09,40.31 69.09,41.56 68.86,42.99 66.35,44.08 63.51,46.14 62.6,47.43 U$4.5
  Bottom 0.203: v56.48,34.44 60.74,34.16 v60.51,33.93
C16  (via drill 0.6)
  Top 0.203: U$5.9 48.05,45.08 50.45,45.29 v52.63,44.65 | v58.64,44.2 60.23,49.6 65.32,49.51 67.81,47.28 U$4.8
  Bottom 0.203: v52.63,44.65 56.89,44.75 v58.64,44.2
C17  (via drill 0.6)
  Top 0.203: U$5.19 47.85,32.16 48.13,32.16 48.5,32.53 50.99,32.53 51.82,32.86 52.65,33.32 53.08,33.47 v55.79,32.92
  Bottom 0.203: v55.79,32.92 59.22,31.45 60.94,32.22 62.02,34.18 61.17,35.33 61.14,41.15 62.71,42.31 U$4.3
C18  (via drill 0.6)
  Top 0.203: v54.84,43.83 56.44,42.52 58.82,42.21 61.33,43.54 65.84,43.3 67.8,42.32 U$4.10
  Bottom 0.203: U$5.10 51.79,43.73 52.71,43.54 v54.84,43.83
CAN_RAW_PLUS
  Bottom 0.203: JP8.3 91.49,38.57 91.49,58.3 | JP7.3 82.69,58.7 91.49,58.3 | 91.49,58.3 91.49,58.39 91.75,70.83
  Bottom 0.406: JP7.3 82.65,58.61 JP7.2 | JP8.3 82.69,36.75 JP8.2
  Bottom 0.61: R1.2 70.32,70.45 77.26,71.86 91.75,70.83
  pour Bottom (rank 2): 80.68,34.89 79.64,35.53 79.85,36.1 82.19,37.34 90.57,39.42 90.56,56.64 87.83,57.55 83.06,57.37 79.99,56.89 79.78,57.85 82.47,59.25 88.25,59.62 90.8,69.92 79.06,71.28 77.77,71.78 78.93,72.22 92.28,71.59 92.58,37.81 83.5,36.13
CANCABLE_1_1
  Bottom 0.406: JP8.1 82.51,34.21 P11.MP
CANCABLE_1_8
  Bottom 0.406: P18.MP 79.25,51.36 JP8.8
CANCABLE_2_1
  Bottom 0.406: P21.MP 78.07,52.58 82.69,56.21 JP7.1
CANCABLE_2_8
  Bottom 0.203: P28.MP 79.48,69.55 80.34,64.87 JP7.8
D1-RESISTOR
  Top 0.203: D1.A 62.77,67.53 | 64.56,70.18 R1.1
  Top 0.61: 62.77,67.53 64.56,70.18
D2-RESISTOR
  Top 0.203: 58.28,70.6 R2.1
  Top 0.61: D2.A 57.1,69.27 58.28,70.6
E5V->NUCLEO  (via drill 0.6)
  Top 0.203: 7.86,3.26 8.34,5.29 8.28,7.5
  Top 0.406: 1.83,3.26 7.86,3.26 | U$2.6 9.59,8.75 8.28,7.5
  Top 0.61: JP5.1 7,46.47 | JP5.1 JP6.1 10.93,46.55 11.04,42.85 D5.C | JP5.1 7.15,46.55 D4.C | 1.83,3.26 v1.95,38.41
  Bottom 0.61: D4.C 4.62,42.08 v1.95,38.41
  pour Top (rank 2): 1.71,4.73 7.17,4.74 7.63,5.76 7.61,9.69 8.71,10.44 10.64,10.45 11.64,9.17 11.73,3.84 10.78,3.17 1.69,3.16
FROM-DC-DC=CAN
  Bottom 0.406: 2.11,1.1 2.38,3.26 2.36,36.32 | C1.1 9.1,36.88 C5.1
  Bottom 0.61: 9.21,36.96 C1.1 | 2.36,36.32 9.21,36.96 | D4.A 7.39,39.89 9.21,36.96
  Bottom 1.016: U$1.4 54.3,1.12 2.11,1.1
FROM-U5V
  Top 0.61: JP5.3 7.15,51.67 JP6.3
  Bottom 0.203: U$2.48 10.29,71.47 3.15,71.62 2.56,69.94 2.78,55.96
  Bottom 0.61: JP5.3 7.23,51.44 2.78,55.96
FROM-USB-UART  (via drill 1 pad 1.02)
  Top 0.813: U$3.4 15.97,20.49 v15.07,22.63
  Bottom 0.305: 13.85,26.58 13.78,32.09
  Bottom 0.61: 13.78,32.09 13.98,32.3 | 11.05,40.19 D5.A
  Bottom 0.813: v15.07,22.63 14.47,24.08 13.85,26.58 | 13.98,32.3 13.77,39.57 11.05,40.19
  pour Bottom (rank 2): 13.04,26.61 10.7,27.52 10.72,31.2 14.04,32.53 17.25,31.19 16.85,27.67 14.19,26.18
GND  (via drill 0.6 pad 1.02)
  other vias: 31.83,49.62 38.8,13.74 41.39,13.89 43.95,13.96 49.22,12.38 53.08,12.32 35.86,14.46 47.49,14.44 51.12,12.61 31.83,54.6 34.67,56.61 20.84,57.17 65,41.44 65.56,53.1
  pour Bottom (rank 3): -0.62,77.95 -0.86,-1.05 101.73,-1.05 102.04,77.87
  pour Top (rank 3): -0.29,-0.5 101.33,-0.56 101.33,3.1 101.49,77.34 -0.45,77.5
MCP2551_CANH
  Top 0.203: JP7.4 77.7,58.38 77.7,39.71 79.96,38.04 JP8.4
  Bottom 0.203: IC103.7 78.59,36.63 79.96,38.13 JP8.4 | U$6.4 72.48,64.4 75.08,63.9 78.31,60.07 80.24,59.89 JP7.4
MCP2551_CANL
  Top 0.203: U$6.3 71.61,62.96 73.8,62.95 79.16,61.15 82.67,61.1 JP7.5 82.6,61.15 86.23,60.34 86.64,39.61 84.27,39.47 82.48,39.28 JP8.5
  Bottom 0.203: IC103.6 78.07,38.07 78.61,39.38 80.32,39.33 81.65,39.4 82.47,39.29 JP8.5
N$3
  Top 0.203: 70.24,66.83 U$6.1 | 70.21,59.13 U$6.7 | 72.83,59.09 U$6.8
  Top 0.61: R2.2 63.06,72.19 65.51,72.19 68.03,69.75 70.24,66.83 | U$6.1 67.46,65.35 67.61,60.41 70.21,59.13 | U$6.7 72.83,59.09
N$4
  Top 0.203: Q1.3 12.09,56.11 D8.A 11.86,56.37 JP2.2
N$5
  Top 0.203: D8.C 11.71,58.95 JP2.3
N$6  (via drill 0.6)
  Top 0.203: U$2.63 31.07,68.21 31.15,71.76 29.61,72.67 v10.51,72.78 | v3.81,72.9 1.99,71.88 2.17,42.27 6.01,38.45 13.27,38.41 24.05,35.15 R7.2 30.41,37.99 JP4.3
  Bottom 0.203: v3.81,72.9 v10.51,72.78
N$7
  Top 0.203: R9.1 19.92,53.24 20.66,56.02 21.83,56.07 LED2.C
N$8
  Bottom 0.203: RH16.1 62.11,58.01 66.15,46.46 67.75,44.88 U$4.9
N$9
  Bottom 0.203: RH15.1 63.17,58.99 67.88,52.5 69.44,47.92 69.32,46.31 68.89,43.22 65.8,44.22 62.57,44.8 U$4.4
N$10  (via drill 0.6)
  Top 0.203: LED1.C 24.55,57.32 v30.42,57.17 | R8.1 29.7,63.45 v30,60.15
  Bottom 0.203: v30.42,57.17 v30,60.15
PB6-I2C1-SCL  (via drill 0.6)  (1 unrouted)
  Top 0.203: U$2.57 26.34,63.08 v28.42,60.08
  Bottom 0.203: v28.42,60.08 29.44,55.82 26.13,51.59 JP1.4
PB7-I2C1-SCL
  Top 0.203: R4.1 23.07,48.97 JP1.3 25.97,49.09 28.19,48.63 33.91,44.53 34.03,30.85 34.08,30.31 34.25,13.71 31.12,10.82 31.2,7.52 U$2.21
PB8-CAN-RX  (via drill 0.6)
  Top 0.203: U$2.43 5.77,68.41 5.79,73.96 7.36,75.33 93.45,75.45 96.29,72.73 96.44,30.25 94.95,28.64 83.15,28.64 74.61,31.94 v70.93,41.9
  Bottom 0.203: IC103.4 71.39,39.22 v70.93,41.9
PB9-CAN-TX  (via drill 0.6)
  Top 0.203: U$2.45 8.15,68.2 8.06,73.05 8.82,73.77 92.76,74.06 94.95,72.29 95.12,32.25 92.21,29.46 83.43,29.46 75.67,32.46 v75.75,32.88
  Bottom 0.203: v75.75,32.88 73.01,32.41 71.15,34.1 71.45,35.49 IC103.1
PC6-Q12-GATE  (via drill 0.6)
  Top 0.203: U$2.44 6.92,73.57 7.69,74.59 93.12,74.84 95.63,72.5 95.8,31.33 v94.23,30.05 | v93.46,27.37 78,23.92 63.73,24.13 63.78,29.49 65.61,29.96 Q12.1
  Bottom 0.203: v94.23,30.05 v93.46,27.37
PC7-LED-GREEN
  Top 0.203: R8.2 27.34,64.82 27.37,66.89 U$2.59
PC8-FETGATE-CHGR-RELAY
  Top 0.203: U$2.42 3.08,67.29 3.38,63.29 4.95,59.36 R3.1 7.04,59.59 Q1.1
PC9-LED-RED
  Top 0.203: R9.2 17.09,58.15 12.01,61.12 6,61.61 4.46,66.8 U$2.41
PC12-SWITCH  (via drill 0.6)
  Top 0.203: R6.2 20.48,46.28 v20.37,43.64
  Bottom 0.203: U$2.3 5.65,7.44 5.64,9.3 6.63,10.09 24.46,11.84 31.29,13.87 31.43,30.52 22.08,33.71 v20.37,43.64
Q12-DRAIN-RELAY
  Top 0.203: U$4.- 67.69,32.99 D3.A 67.78,28.9 Q12.3
USART3-RX
  Bottom 0.203: U$2.2 4.32,10.35 8.63,12.7 8.75,16.63 17.84,19.64 23.58,25.93 25.26,29.56 U$3.10 25.22,29.48 24.98,25.15 JP3.4
USART3-TX
  Top 0.203: U$2.1 5.68,6.96 5.62,10.78 6.19,13.33 6.31,23.88 13.52,26.31 15.17,29.48 U$3.14 15.09,29.35 15.95,27.5 16.9,24.78 JP3.5

### Text on the board
bNames: 5
tValues: 3.3V | DIGITAL | +5V | 3.2v | ANALOG | 3.2